# Altium schematic sheet Audio_Output.SchDoc: Audio Output
size A4; DocumentNumber: 8; SheetNumber: 8; SheetTotal: 8
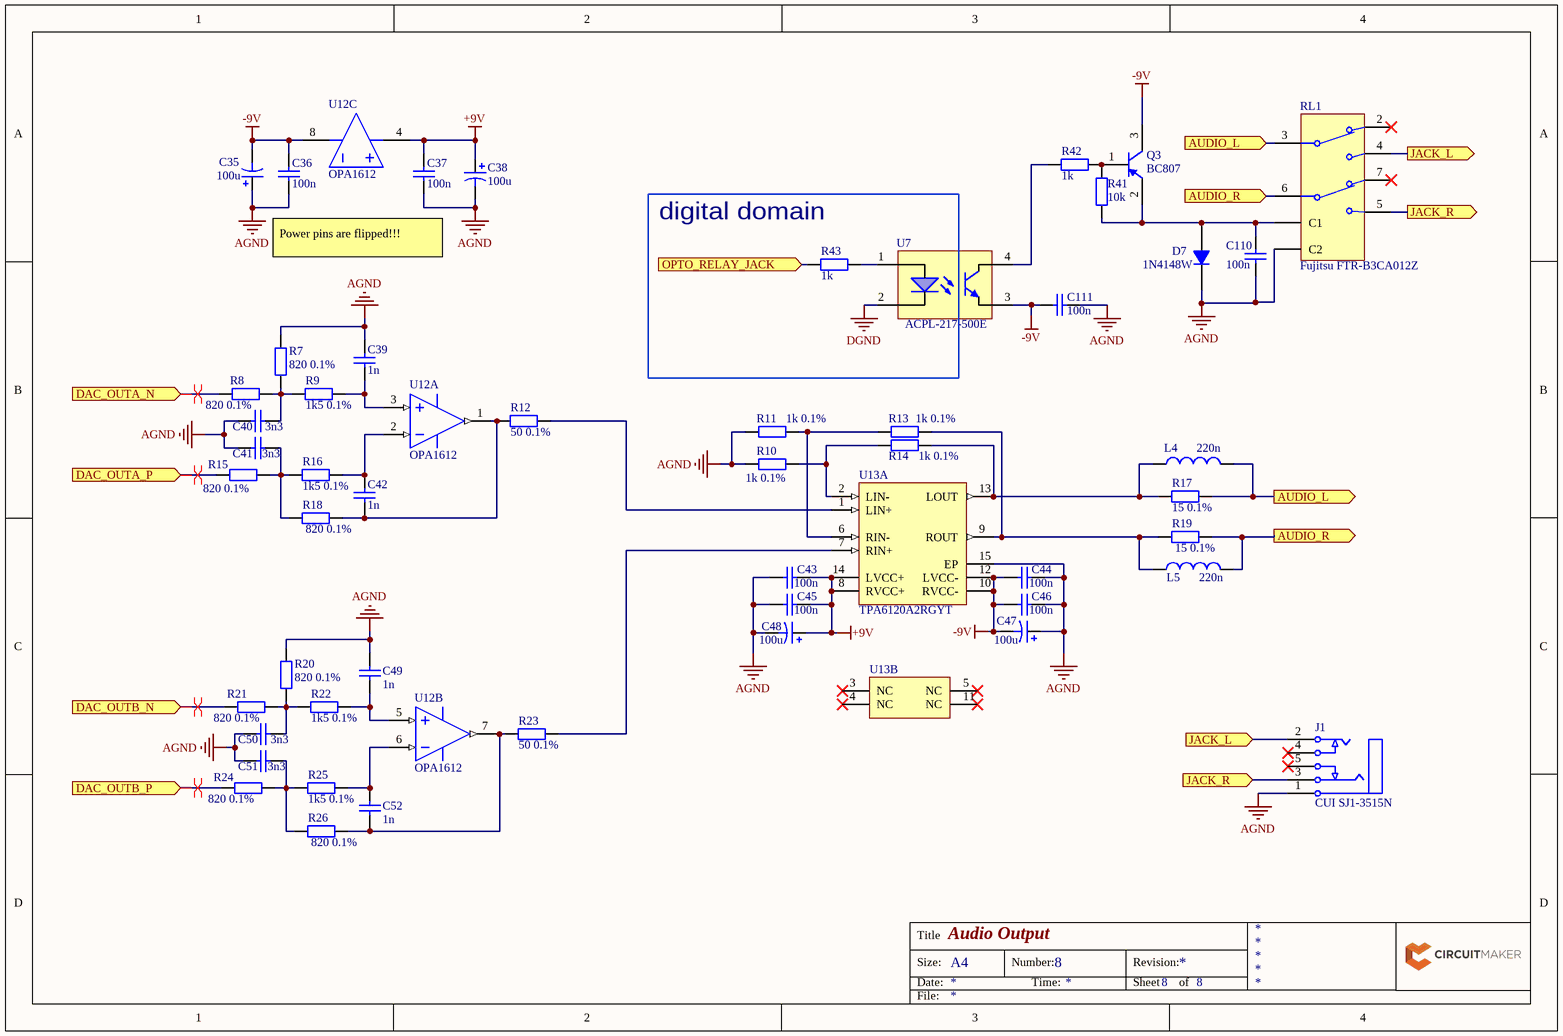
[diagram p0: Audio_Output.SchDoc]

## Parts
C35  100u  [PCB-9bfrndi9huxo1n7cihpl-1]
C36  100n  [PCB-rf0pzaa82dpbeu9l4sxm-1]
C37  100n  [PCB-rf0pzaa82dpbeu9l4sxm-1]
C38  100u  [PCB-9bfrndi9huxo1n7cihpl-1]
C39  1n  [PCB-rf0pzaa82dpbeu9l4sxm-1]
C40  3n3  [PCB-rf0pzaa82dpbeu9l4sxm-1]
C41  3n3  [PCB-rf0pzaa82dpbeu9l4sxm-1]
C42  1n  [PCB-rf0pzaa82dpbeu9l4sxm-1]
C43  100n  [PCB-rf0pzaa82dpbeu9l4sxm-1]
C44  100n  [PCB-rf0pzaa82dpbeu9l4sxm-1]
C45  100n  [PCB-rf0pzaa82dpbeu9l4sxm-1]
C46  100n  [PCB-rf0pzaa82dpbeu9l4sxm-1]
C47  100u  [PCB-9bfrndi9huxo1n7cihpl-1]
C48  100u  [PCB-9bfrndi9huxo1n7cihpl-1]
C49  1n  [PCB-rf0pzaa82dpbeu9l4sxm-1]
C50  3n3  [PCB-rf0pzaa82dpbeu9l4sxm-1]
C51  3n3  [PCB-rf0pzaa82dpbeu9l4sxm-1]
C52  1n  [PCB-rf0pzaa82dpbeu9l4sxm-1]
C110  100n  [PCB-rf0pzaa82dpbeu9l4sxm-1]
C111  100n  [PCB-rf0pzaa82dpbeu9l4sxm-1]
D7  1N4148W  [PCB-dk2zqfkr0dm389ntik9k-1]
J1  CUI SJ1-3515N  [PCB-j9vj6bmn4rccphvinwcn-1]
L4  220n  [PCB-0z5abqka5wqo6pkabrtd-1]
L5  220n  [PCB-0z5abqka5wqo6pkabrtd-1]
Q3  BC807  [ONSC-SOT-23-3-318-08_V]
R7  820 0.1%  [PCB-3d5y3t7f8drf35yjcj59-1]
R8  820 0.1%  [PCB-3d5y3t7f8drf35yjcj59-1]
R9  1k5 0.1%  [PCB-3d5y3t7f8drf35yjcj59-1]
R10  1k 0.1%  [PCB-3d5y3t7f8drf35yjcj59-1]
R11  1k 0.1%  [PCB-3d5y3t7f8drf35yjcj59-1]
R12  50 0.1%  [PCB-3d5y3t7f8drf35yjcj59-1]
R13  1k 0.1%  [PCB-3d5y3t7f8drf35yjcj59-1]
R14  1k 0.1%  [PCB-3d5y3t7f8drf35yjcj59-1]
R15  820 0.1%  [PCB-3d5y3t7f8drf35yjcj59-1]
R16  1k5 0.1%  [PCB-3d5y3t7f8drf35yjcj59-1]
R17  15 0.1%  [PCB-3d5y3t7f8drf35yjcj59-1]
R18  820 0.1%  [PCB-3d5y3t7f8drf35yjcj59-1]
R19  15 0.1%  [PCB-3d5y3t7f8drf35yjcj59-1]
R20  820 0.1%  [PCB-3d5y3t7f8drf35yjcj59-1]
R21  820 0.1%  [PCB-3d5y3t7f8drf35yjcj59-1]
R22  1k5 0.1%  [PCB-3d5y3t7f8drf35yjcj59-1]
R23  50 0.1%  [PCB-3d5y3t7f8drf35yjcj59-1]
R24  820 0.1%  [PCB-3d5y3t7f8drf35yjcj59-1]
R25  1k5 0.1%  [PCB-3d5y3t7f8drf35yjcj59-1]
R26  820 0.1%  [PCB-3d5y3t7f8drf35yjcj59-1]
R41  10k  [PCB-3d5y3t7f8drf35yjcj59-1]
R42  1k  [PCB-3d5y3t7f8drf35yjcj59-1]
R43  1k  [PCB-3d5y3t7f8drf35yjcj59-1]
RL1  Fujitsu FTR-B3CA012Z  [PCB-79j3gj3ralb8es1cyg77-1]
U7  ACPL-217-500E  [PCB-tryrgihdrozpg2dv6q87-1]
U12  OPA1612  [TI-D8_M]  (parts A,B,C of 3)
U13  TPA6120A2RGYT  [RGY14-2050X2050TP]  (parts A,B of 2)

## Blocks framed on the sheet
digital domain: R43 U7

## Ports
AUDIO_L (in), AUDIO_L (out), AUDIO_R (in), AUDIO_R (out), DAC_OUTA_N (in), DAC_OUTA_P (in), DAC_OUTB_N (in), DAC_OUTB_P (in), JACK_L (in), JACK_L (out), JACK_R (in), JACK_R (out), OPTO_RELAY_JACK (in)

## Nets
+9V: C37.1 C38.1 C43.2 C45.2 C48.1 U12.4(V-) U13.8(RVCC+) U13.14(LVCC+)
-9V: C35.2 C36.1 C44.1 C46.1 C47.2 C111.1 Q3.3(C) U7.3 U12.8(V+) U13.10(RVCC-) U13.12(LVCC-)
AGND: C35.1 C36.2 C37.2 C38.2 C39.1 C40.1 C41.1 C43.1 C44.2 C45.1 C46.2 C47.1 C48.2 C49.2 C50.2 C51.1 C110.1 C111.2 D7.2(K) J1.1(SLEEVE) R7.2 R10.2 R11.2 R20.2 RL1.8(C2) U13.15(EP)
DGND: U7.2
AUDIO_L: L4.2 R17.2 RL1.3 ; port AUDIO_L
AUDIO_R: L5.2 R19.2 RL1.6 ; port AUDIO_R
DAC_OUTA_N: R8.2 ; port DAC_OUTA_N
DAC_OUTA_P: R15.2 ; port DAC_OUTA_P
DAC_OUTB_N: R21.2 ; port DAC_OUTB_N
DAC_OUTB_P: R24.2 ; port DAC_OUTB_P
JACK_L: J1.2(TIP) RL1.4 ; port JACK_L
JACK_R: J1.3(RING) RL1.5 ; port JACK_R
OPTO_RELAY_JACK: R43.2 ; port OPTO_RELAY_JACK
NetC39_2: C39.2 R9.2 U12.3(IN_A+)
NetC40_2: C40.2 R7.1 R8.1 R9.1
NetC41_2: C41.2 R15.1 R16.1 R18.2
NetC42_1: C42.1 R16.2 U12.2(IN_A-)
NetC42_2: C42.2 R12.1 R18.1 U12.1(OUT_A)
NetC49_1: C49.1 R22.2 U12.5(IN_B+)
NetC50_1: C50.1 R20.1 R21.1 R22.1
NetC51_2: C51.2 R24.1 R25.1 R26.2
NetC52_1: C52.1 R23.1 R26.1 U12.7(OUT_B)
NetC52_2: C52.2 R25.2 U12.6(IN_B-)
NetC110_2: C110.2 D7.1(A) Q3.2(E) R41.2 RL1.1(C1)
NetL4_1: L4.1 R14.1 R17.1 U13.13(LOUT)
NetL5_1: L5.1 R13.1 R19.1 U13.9(ROUT)
NetQ3_1: Q3.1(B) R41.1 R42.1
NetR10_1: R10.1 R14.2 U13.2(LIN-)
NetR11_1: R11.1 R13.2 U13.6(RIN-)
NetR12_2: R12.2 U13.1(LIN+)
NetR23_2: R23.2 U13.7(RIN+)
NetR42_2: R42.2 U7.4
NetR43_1: R43.1 U7.1(A)

Not connected (* = marked no-connect by the designer): J1 4* 5*; RL1 2* 7*; U13 3(NC)* 4(NC)* 5(NC)* 11(NC)*

## Layout directives
differential pair: DAC_OUTA_N, DAC_OUTA_P, DAC_OUTB_N, DAC_OUTB_P

## Notes on the sheet
- Power pins are flipped!!!
- Title
- Size:
- Date:
- A4
- Number:
- Time:
- Revision:
- Sheet
- of
- File:

## Library data of the parts
C35 C38 C47 C48 = CMP-6546a831a81eba81-4: In a Pack of 25, KEMET 100?F Electrolytic Capacitor 10V dc Through Hole - A758EK107M1AAAE016; Capacitance: 100 µF; Equivalent Series Resistance (ESR): 16.0 m?; Voltage Rating (DC): 10.0 V; Capacitance Tolerance: ±20%; Mounting Style: Through Hole; Size-Diameter: 6.30 mm; Size-Height: 8.00 mm; Operating Temperature: 105 °C (max); RoHS: Compliant; Manufacturer Part Number: A758EK107M1AAAE016; Octopart URL: https://octopart.com/a758ek107m1aaae016-kemet-75360318; OctopartID: 6546a831a81eba81
C36 C37 C39-C46 C49-C52 C110 C111 = CMP-x8hddryxw4o380xfi98v-3: Generic Capacitor 0603; CustomComponentID: x8hddryxw4o380xfi98v
  C36 C37 C43-C46 C110 C111: LCSC Part #: C14663; LCSC Part #: C19702; LCSC Part #: C25804
D7 = CMP-791fb3587d52a6d8-24: Small Signal Diode, Single, 100 V, 300 Ma, 1.25 V, 4 Ns, 2 A Rohs Compliant: Yes; Power Dissipation: 400 mW (max); Polarity: Standard; Capacitance: 2.00 pF; Power Rating: 400 mW; REACH SVHC Compliance: No SVHC; Operating Temperature: -65.0 °C to 150 °C; OctopartID: 791fb3587d52a6d8; Number of Pins: 2; Mounting Style: Surface Mount; Lifecycle Status: Active; RoHS: Compliant; Octopart URL: https://octopart.com/1n4148w-7-f-diodes+inc.-55386411; LCSC Part #: C81598; LCSC Part #: C1546; LCSC Part #: C23265; LCSC Part #: C23345
J1 = CMP-62caabc32dc3bd0d-2: 3.5 mm Right-Angle Stereo Jack, 5 Pin PCB Mount, Non-Threaded; Lead-Free Status: Lead Free; Mounting Angle: 90.0 °; Shielding: No; Gender: Female; OctopartID: 62caabc32dc3bd0d; Contact Plating: Silver; RoHS: Compliant; Octopart URL: http://octopart.com/sj1-3515n-cui-223855; Orientation: Horizontal; Size-Diameter: 3.50 mm; Manufacturer Part Number: SJ1-3515N; Color: Black; Mounting Style: Through Hole; Lifecycle Status: Active; Packaging: Bulk
L4 L5 = CMP-2243ea3eb191fd84-1: RF inductor, air core, 2% tol, SMT, RoHS, halogen-free; Manufacturer Part Number: 2222SQ-221GEB; Current Rating: 5.00 A; Inductance: 220 nH; Lead-Free Status: Contains Lead; Q-Factor: 140.0; Self Resonant Frequency: 1.00 GHz; Octopart URL: https://octopart.com/2222sq-221geb-coilcraft-24622772; Lifecycle Status: Active; Mounting Style: Surface Mount; Packaging: Cut Tape (CT); REACH SVHC Compliance: No SVHC; RoHS: Compliant; OctopartID: 2243ea3eb191fd84
Q3 = CMP-857821-2: General Purpose Transistor, PNP Silicon, 3-Pin SOT-23, Pb-Free, Tape and Reel; Manufacturer Part Number: BC807-16LT1G; Lead-Free Status: Lead Free; Case/Package: SOT-23-3; Halogen Free Status: Halogen Free; Lifecycle Status: Active; Mounting Style: Surface Mount; Number of Pins: 3; Octopart Url: https://octopart.com/bc807-16lt1g-on+semiconductor-46514747; OctopartID: afbd647248e0707a; Polarity: PNP; REACH SVHC Compliance: No SVHC; RoHS: Compliant
R7-R26 R41-R43 = CMP-xcu3s4ikiffkkgbeyow5-1: Resistor 0603; CustomComponentID: xcu3s4ikiffkkgbeyow5
  R41: LCSC Part #: C25804; LCSC Part #: C21190
  R42 R43: LCSC Part #: C21190
RL1 = CMP-2945e043254ff682-1: Miniature Relay 2A, coil voltage 12V DC, 2 changeover contact (2C), 1A/30V DC, 0.3A/125VAC; Coil Voltage: 12.0 V; Contacts Type: DPDT; Power Consumption: 140 mW; Octopart URL: https://octopart.com/ftr-b3ca012z-fujitsu-797036; Manufacturer Part Number: FTR-B3CA012Z; Mounting Style: PCB; RoHS: Compliant; OctopartID: 2945e043254ff682
U7 = CMP-7a61b307eb6fa5a6-3: Optocoupler; SMD; Channels: 1; Out: transistor; 3kV; SO4; Power Dissipation: 200 mW; Lead-Free Status: Lead Free; Isolation Voltage: 3.00 kV; Output Voltage: 80.0 V; Input Current: 20.0 mA; Packaging: Tape & Reel (TR), Cut Tape (CT); REACH SVHC Compliance: No SVHC; RoHS: Compliant; Number of Pins: 4; Lifecycle Status: Active; Case/Package: SOIC; Mounting Style: Surface Mount; Manufacturer Part Number: ACPL-217-500E; Octopart URL: http://octopart.com/acpl-217-500e-avago-7124072; OctopartID: 7a61b307eb6fa5a6
U12 = CMP-1335515-4: 1.1 nV/rtHz Noise, Low Power, Precision Operational Amplifier, 4.5 to 36 V, -40 to 85 degC, 8-pin SOIC (D8), Green (RoHS & no Sb/Br); Manufacturer Part Number: OPA1612AIDR; Lead-Free Status: Lead Free; Gain Bandwidth Product: 40000000.0 Hz; Input Offset Drift: 1e-06 V/K; Slew Rate: 27.0 V/μs; Number of Channels: 2; Octopart Url: https://octopart.com/opa1612aidr-texas+instruments-12192553; OctopartID: f9273097d76826e0; Case/Package: SOIC; RoHS: Compliant; Number of Pins: 8; Lifecycle Status: Active
U13 = CMP-19855737-3: HEADPHONE AMP, CLASS AB, VQFN-14; Lead-Free Status: Lead Free; Output Power: 1.5 W; Manufacturer Part Number: TPA6120A2RGYT; Lifecycle Status: Active; Number of Pins: 14; Octopart Url: https://octopart.com/tpa6120a2rgyt-texas+instruments-47324054; OctopartID: 08efc337361fd728; Packaging: Cut Tape (CT); REACH SVHC Compliance: No SVHC; RoHS: Compliant